# EasyEDA Pro project uven2-mk3-cc-driver-20x.eprj, board PCB1
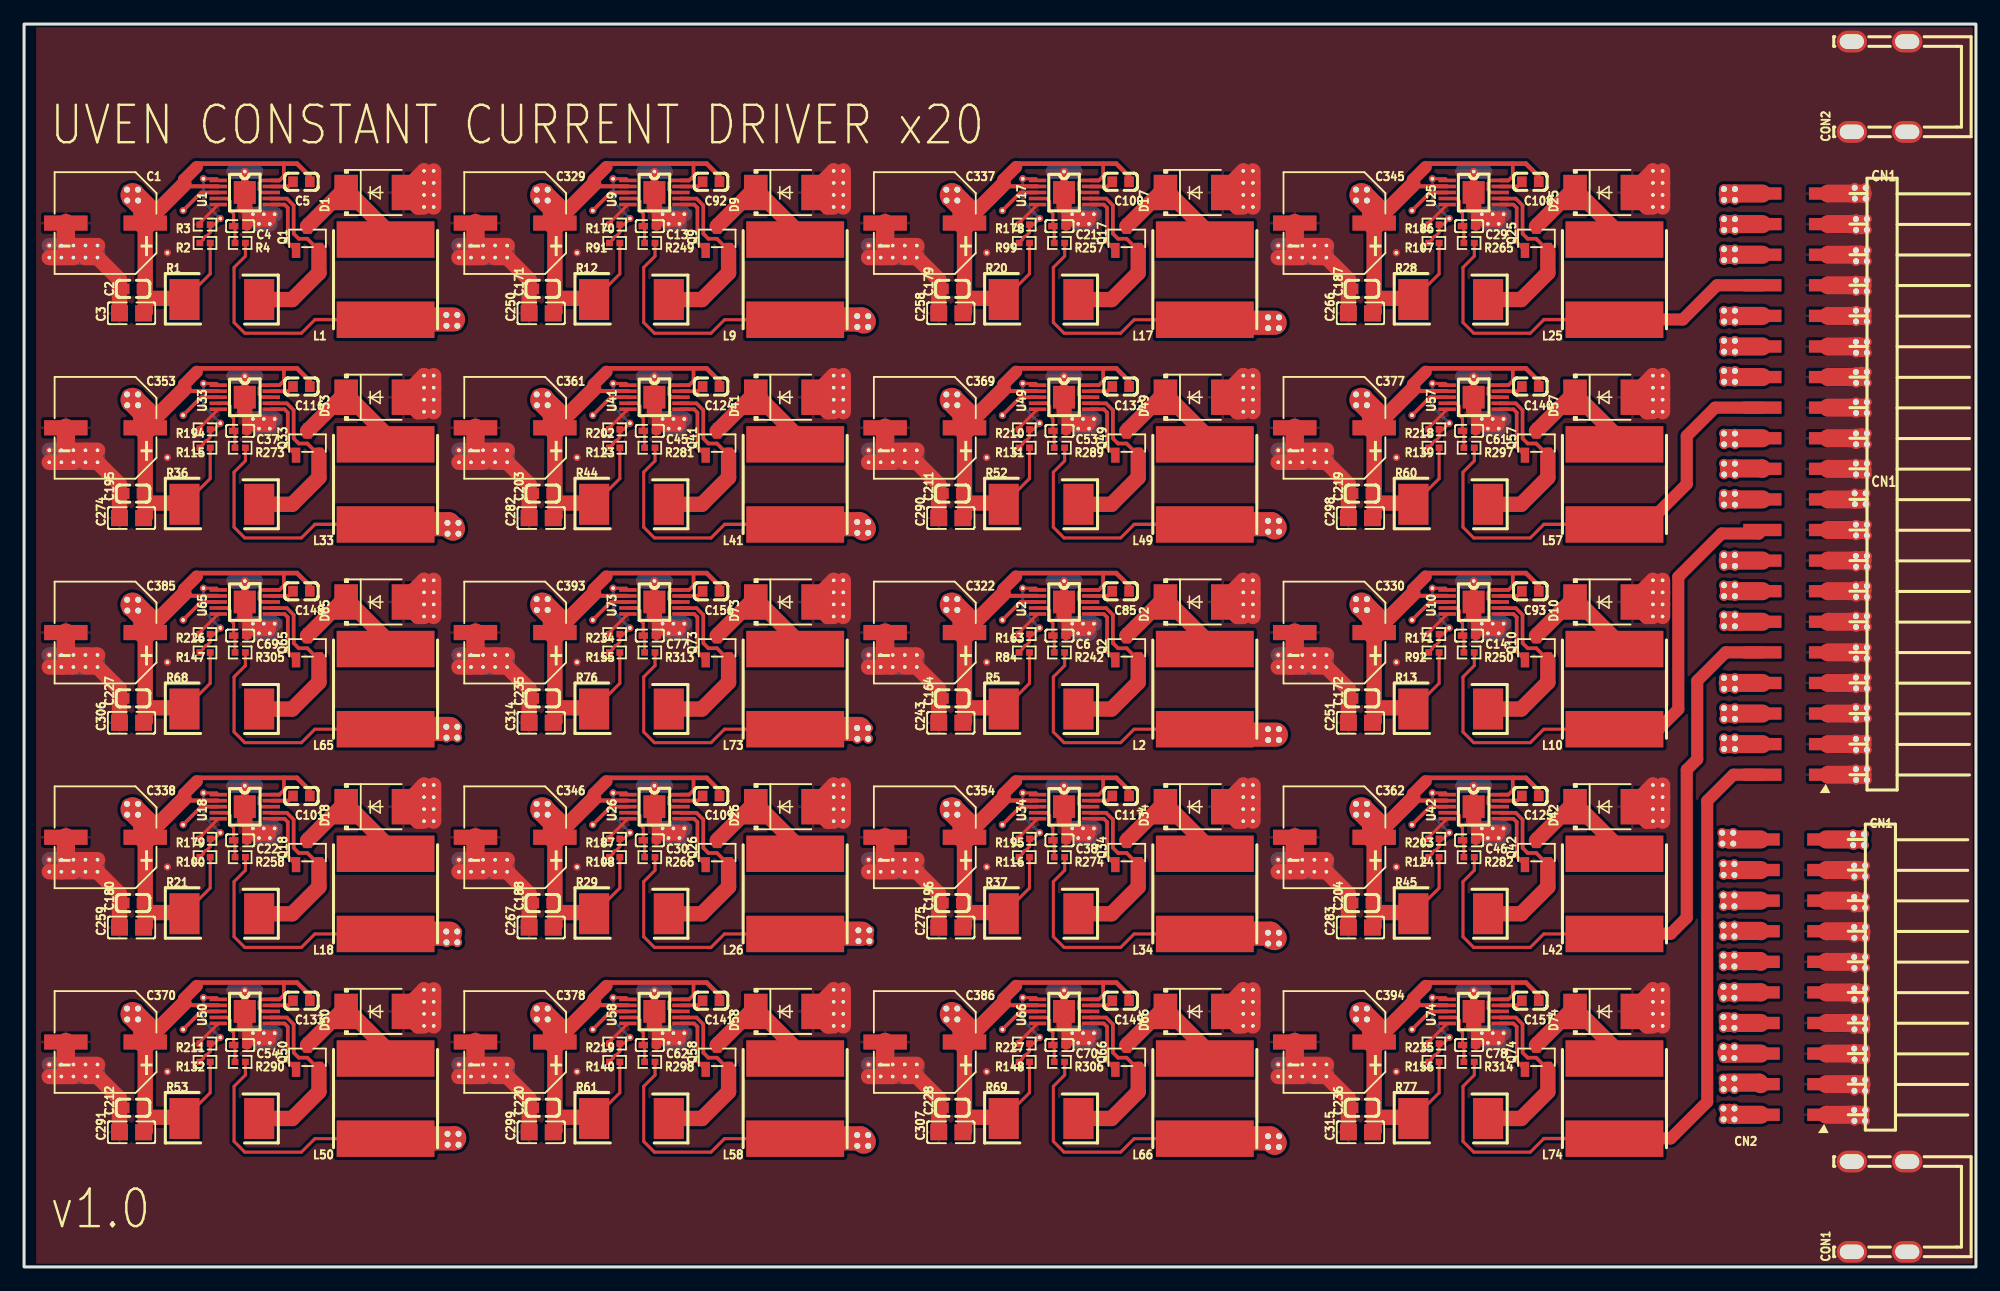
[diagram p4: board, top side]
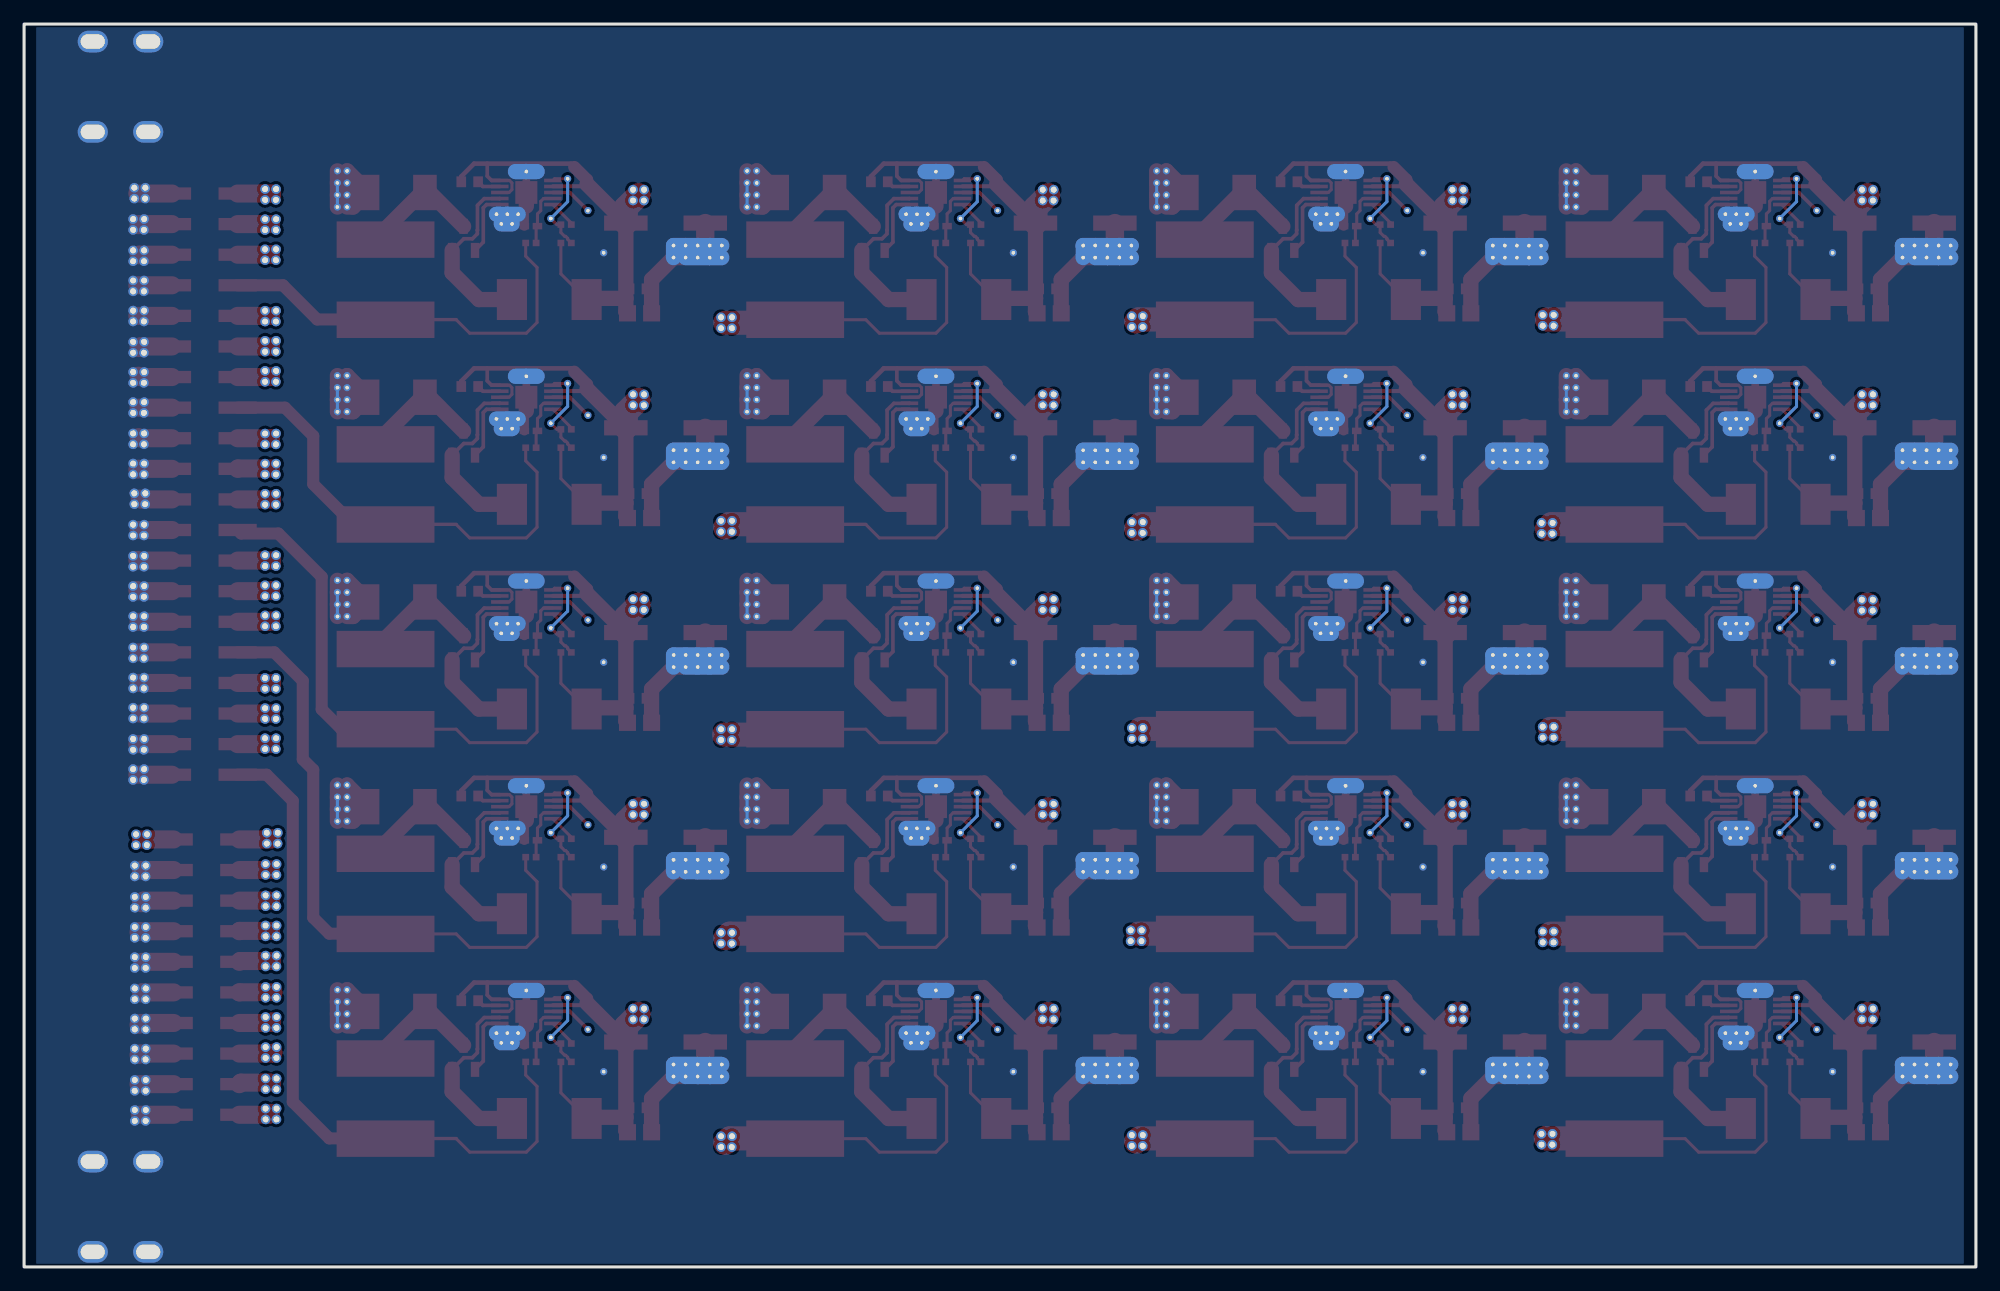
[diagram p5: board, bottom side, seen from below]

Outline 162 x 103.2 mm; copper layers: Top Layer, Inner1, Inner2, Bottom Layer. Coordinates in mm from the lower left corner of the outline.
Outline path: rectangle 0,103.2 162,0
Stack: Top Layer 0.035mm Outer layer thickness 1oz / Dielectric1 0.2104mm 7628 RC49% 8.6mil / Inner1 0.0152mm Inner layer thickness / Dielectric2 1.065mm 1.1mm H/HOZ Copper / Inner2 0.0152mm Inner layer thickness / Dielectric3 0.2104mm 7628 RC49% 8.6mil / Bottom Layer 0.035mm Outer layer thickness 1oz

## Design rules (mm)
template: Custom Config
spacing copperThickness1oz (default): track to track 0.102, other pairs 0.152 to 0.3
spacing copperThickness2oz: track to track 0.203, other pairs 0.152 to 0.3
track width copperThickness1oz (default): min 0.127, default 0.254, max 2.54
track width copperThickness2oz: min 0.203, default 0.254, max 2.54
differential pair differentialPair (default): width min 0.127, default 0.254, max 2.54; gap min 0.152, default 0.152
via viaSize (default): diameter min 0.5, default 0.61, max 10; hole min 0.3, default 0.305, max 6.3
pour e2918 uses copperRegion

## Placement (name value [footprint] x y rotation side)
C1  470uF  [CAP-SMD_BD8.0-L8.3-W8.3-LS9.1-FD]  6.76 86.68 180 top
C2  1uF  [C0603]  9.05 81.21 0 top
C3  10uF  [C0805]  8.92 79.18 0 top
C4  1nF  [C0402]  17.94 86.42 180 top
C5  1uF  [C0603]  23.02 90.1 0 top
C6  1nF  [C0402]  85.94 52.42 180 top
C13  1nF  [C0402]  51.94 86.42 180 top
C14  1nF  [C0402]  119.94 52.42 180 top
C21  1nF  [C0402]  85.94 86.42 180 top
C22  1nF  [C0402]  17.94 35.42 180 top
C29  1nF  [C0402]  119.94 86.42 180 top
C30  1nF  [C0402]  51.94 35.42 180 top
C37  1nF  [C0402]  17.94 69.42 180 top
C38  1nF  [C0402]  85.94 35.42 180 top
C45  1nF  [C0402]  51.94 69.42 180 top
C46  1nF  [C0402]  119.94 35.42 180 top
C53  1nF  [C0402]  85.94 69.42 180 top
C54  1nF  [C0402]  17.94 18.42 180 top
C61  1nF  [C0402]  119.94 69.42 180 top
C62  1nF  [C0402]  51.94 18.42 180 top
C69  1nF  [C0402]  17.94 52.42 180 top
C70  1nF  [C0402]  85.94 18.42 180 top
C77  1nF  [C0402]  51.94 52.42 180 top
C78  1nF  [C0402]  119.94 18.42 180 top
C85  1uF  [C0603]  91.01 56.1 0 top
C92  1uF  [C0603]  57.01 90.1 0 top
C93  1uF  [C0603]  125.01 56.1 0 top
C100  1uF  [C0603]  91.01 90.1 0 top
C101  1uF  [C0603]  23.02 39.1 0 top
C108  1uF  [C0603]  125.01 90.1 0 top
C109  1uF  [C0603]  57.01 39.1 0 top
C116  1uF  [C0603]  23.02 73.1 0 top
C117  1uF  [C0603]  91.01 39.1 0 top
C124  1uF  [C0603]  57.01 73.1 0 top
C125  1uF  [C0603]  125.01 39.1 0 top
C132  1uF  [C0603]  91.01 73.1 0 top
C133  1uF  [C0603]  23.02 22.1 0 top
C140  1uF  [C0603]  125.01 73.1 0 top
C141  1uF  [C0603]  57.01 22.1 0 top
C148  1uF  [C0603]  23.02 56.1 0 top
C149  1uF  [C0603]  91.01 22.1 0 top
C156  1uF  [C0603]  57.01 56.1 0 top
C157  1uF  [C0603]  125.01 22.1 0 top
C164  1uF  [C0603]  77.04 47.21 0 top
C171  1uF  [C0603]  43.05 81.21 0 top
C172  1uF  [C0603]  111.04 47.21 0 top
C179  1uF  [C0603]  77.04 81.21 0 top
C180  1uF  [C0603]  9.05 30.21 0 top
C187  1uF  [C0603]  111.04 81.21 0 top
C188  1uF  [C0603]  43.05 30.21 0 top
C195  1uF  [C0603]  9.05 64.21 0 top
C196  1uF  [C0603]  77.04 30.21 0 top
C203  1uF  [C0603]  43.05 64.21 0 top
C204  1uF  [C0603]  111.04 30.21 0 top
C211  1uF  [C0603]  77.04 64.21 0 top
C212  1uF  [C0603]  9.05 13.21 0 top
C219  1uF  [C0603]  111.04 64.21 0 top
C220  1uF  [C0603]  43.05 13.21 0 top
C227  1uF  [C0603]  9.05 47.21 0 top
C228  1uF  [C0603]  77.04 13.21 0 top
C235  1uF  [C0603]  43.05 47.21 0 top
C236  1uF  [C0603]  111.04 13.21 0 top
C243  10uF  [C0805]  76.92 45.18 0 top
C250  10uF  [C0805]  42.92 79.18 0 top
C251  10uF  [C0805]  110.92 45.18 0 top
C258  10uF  [C0805]  76.92 79.18 0 top
C259  10uF  [C0805]  8.92 28.18 0 top
C266  10uF  [C0805]  110.92 79.18 0 top
C267  10uF  [C0805]  42.92 28.18 0 top
C274  10uF  [C0805]  8.92 62.18 0 top
C275  10uF  [C0805]  76.92 28.18 0 top
C282  10uF  [C0805]  42.92 62.18 0 top
C283  10uF  [C0805]  110.92 28.18 0 top
C290  10uF  [C0805]  76.92 62.18 0 top
C291  10uF  [C0805]  8.92 11.18 0 top
C298  10uF  [C0805]  110.92 62.18 0 top
C299  10uF  [C0805]  42.92 11.18 0 top
C306  10uF  [C0805]  8.92 45.18 0 top
C307  10uF  [C0805]  76.92 11.18 0 top
C314  10uF  [C0805]  42.92 45.18 0 top
C315  10uF  [C0805]  110.92 11.18 0 top
C322  470uF  [CAP-SMD_BD8.0-L8.3-W8.3-LS9.1-FD]  74.76 52.68 180 top
C329  470uF  [CAP-SMD_BD8.0-L8.3-W8.3-LS9.1-FD]  40.76 86.68 180 top
C330  470uF  [CAP-SMD_BD8.0-L8.3-W8.3-LS9.1-FD]  108.76 52.68 180 top
C337  470uF  [CAP-SMD_BD8.0-L8.3-W8.3-LS9.1-FD]  74.76 86.68 180 top
C338  470uF  [CAP-SMD_BD8.0-L8.3-W8.3-LS9.1-FD]  6.76 35.68 180 top
C345  470uF  [CAP-SMD_BD8.0-L8.3-W8.3-LS9.1-FD]  108.76 86.68 180 top
C346  470uF  [CAP-SMD_BD8.0-L8.3-W8.3-LS9.1-FD]  40.76 35.68 180 top
C353  470uF  [CAP-SMD_BD8.0-L8.3-W8.3-LS9.1-FD]  6.76 69.68 180 top
C354  470uF  [CAP-SMD_BD8.0-L8.3-W8.3-LS9.1-FD]  74.76 35.68 180 top
C361  470uF  [CAP-SMD_BD8.0-L8.3-W8.3-LS9.1-FD]  40.76 69.68 180 top
C362  470uF  [CAP-SMD_BD8.0-L8.3-W8.3-LS9.1-FD]  108.76 35.68 180 top
C369  470uF  [CAP-SMD_BD8.0-L8.3-W8.3-LS9.1-FD]  74.76 69.68 180 top
C370  470uF  [CAP-SMD_BD8.0-L8.3-W8.3-LS9.1-FD]  6.76 18.68 180 top
C377  470uF  [CAP-SMD_BD8.0-L8.3-W8.3-LS9.1-FD]  108.76 69.68 180 top
C378  470uF  [CAP-SMD_BD8.0-L8.3-W8.3-LS9.1-FD]  40.76 18.68 180 top
C385  470uF  [CAP-SMD_BD8.0-L8.3-W8.3-LS9.1-FD]  6.76 52.68 180 top
C386  470uF  [CAP-SMD_BD8.0-L8.3-W8.3-LS9.1-FD]  74.76 18.68 180 top
C393  470uF  [CAP-SMD_BD8.0-L8.3-W8.3-LS9.1-FD]  40.76 52.68 180 top
C394  470uF  [CAP-SMD_BD8.0-L8.3-W8.3-LS9.1-FD]  108.76 18.68 180 top
CN1  PZ254-2-20-WS  [HDR-SMD_40P-P2.54-H-M-R2-C20_L8.5]  147 65 90 top
CN2  PZ254-2-10-WS  [HDR-SMD_20P-P2.54-H-M-R2-C10_L8.5]  146.86 24.06 90 top
CON1  TTR34083132-1140  [TH-4_L11.4-W8.3_TTR34083132-1140]  154 5 90 top
CON2  TTR34083132-1140  [TH-4_L11.4-W8.3_TTR34083132-1140]  154 98 90 top
D1  SR34_R2_00001  [SMB_L4.3-W3.6-LS5.4-R-RD]  29.11 89.22 0 top
D2  SR34_R2_00001  [SMB_L4.3-W3.6-LS5.4-R-RD]  97.11 55.22 0 top
D9  SR34_R2_00001  [SMB_L4.3-W3.6-LS5.4-R-RD]  63.11 89.22 0 top
D10  SR34_R2_00001  [SMB_L4.3-W3.6-LS5.4-R-RD]  131.11 55.22 0 top
D17  SR34_R2_00001  [SMB_L4.3-W3.6-LS5.4-R-RD]  97.11 89.22 0 top
D18  SR34_R2_00001  [SMB_L4.3-W3.6-LS5.4-R-RD]  29.11 38.22 0 top
D25  SR34_R2_00001  [SMB_L4.3-W3.6-LS5.4-R-RD]  131.11 89.22 0 top
D26  SR34_R2_00001  [SMB_L4.3-W3.6-LS5.4-R-RD]  63.11 38.22 0 top
D33  SR34_R2_00001  [SMB_L4.3-W3.6-LS5.4-R-RD]  29.11 72.22 0 top
D34  SR34_R2_00001  [SMB_L4.3-W3.6-LS5.4-R-RD]  97.11 38.22 0 top
D41  SR34_R2_00001  [SMB_L4.3-W3.6-LS5.4-R-RD]  63.11 72.22 0 top
D42  SR34_R2_00001  [SMB_L4.3-W3.6-LS5.4-R-RD]  131.11 38.22 0 top
D49  SR34_R2_00001  [SMB_L4.3-W3.6-LS5.4-R-RD]  97.11 72.22 0 top
D50  SR34_R2_00001  [SMB_L4.3-W3.6-LS5.4-R-RD]  29.11 21.22 0 top
D57  SR34_R2_00001  [SMB_L4.3-W3.6-LS5.4-R-RD]  131.11 72.22 0 top
D58  SR34_R2_00001  [SMB_L4.3-W3.6-LS5.4-R-RD]  63.11 21.22 0 top
D65  SR34_R2_00001  [SMB_L4.3-W3.6-LS5.4-R-RD]  29.11 55.22 0 top
D66  SR34_R2_00001  [SMB_L4.3-W3.6-LS5.4-R-RD]  97.11 21.22 0 top
D73  SR34_R2_00001  [SMB_L4.3-W3.6-LS5.4-R-RD]  63.11 55.22 0 top
D74  SR34_R2_00001  [SMB_L4.3-W3.6-LS5.4-R-RD]  131.11 21.22 0 top
L1  15uH  [IND-SMD_L8.0-W8.0-HPC8040NF-150M]  30 81.98 90 top
L2  15uH  [IND-SMD_L8.0-W8.0-HPC8040NF-150M]  98 47.98 90 top
L9  15uH  [IND-SMD_L8.0-W8.0-HPC8040NF-150M]  64 81.98 90 top
L10  15uH  [IND-SMD_L8.0-W8.0-HPC8040NF-150M]  132 47.98 90 top
L17  15uH  [IND-SMD_L8.0-W8.0-HPC8040NF-150M]  98 81.98 90 top
L18  15uH  [IND-SMD_L8.0-W8.0-HPC8040NF-150M]  30 30.98 90 top
L25  15uH  [IND-SMD_L8.0-W8.0-HPC8040NF-150M]  132 81.98 90 top
L26  15uH  [IND-SMD_L8.0-W8.0-HPC8040NF-150M]  64 30.98 90 top
L33  15uH  [IND-SMD_L8.0-W8.0-HPC8040NF-150M]  30 64.98 90 top
L34  15uH  [IND-SMD_L8.0-W8.0-HPC8040NF-150M]  98 30.98 90 top
L41  15uH  [IND-SMD_L8.0-W8.0-HPC8040NF-150M]  64 64.98 90 top
L42  15uH  [IND-SMD_L8.0-W8.0-HPC8040NF-150M]  132 30.98 90 top
L49  15uH  [IND-SMD_L8.0-W8.0-HPC8040NF-150M]  98 64.98 90 top
L50  15uH  [IND-SMD_L8.0-W8.0-HPC8040NF-150M]  30 13.98 90 top
L57  15uH  [IND-SMD_L8.0-W8.0-HPC8040NF-150M]  132 64.98 90 top
L58  15uH  [IND-SMD_L8.0-W8.0-HPC8040NF-150M]  64 13.98 90 top
L65  15uH  [IND-SMD_L8.0-W8.0-HPC8040NF-150M]  30 47.98 90 top
L66  15uH  [IND-SMD_L8.0-W8.0-HPC8040NF-150M]  98 13.98 90 top
L73  15uH  [IND-SMD_L8.0-W8.0-HPC8040NF-150M]  64 47.98 90 top
L74  15uH  [IND-SMD_L8.0-W8.0-HPC8040NF-150M]  132 13.98 90 top
NOREF  -  [Pad_e3252]  152.81 30.72 0 top
NOREF#2  -  [Pad_e7711]  107.09 66.81 0 top
NOREF#3  -  [Pad_e7423]  101.19 73.01 0 top
NOREF#4  -  [Pad_e3453]  152.95 42.94 0 top
NOREF#5  -  [Pad_e6207]  19.49 35.61 0 top
NOREF#6  -  [Pad_e7069]  67.19 73.01 0 top
NOREF#7  -  [Pad_e11088]  8.56 71.55 0 top
NOREF#8  -  [Pad_e5895]  104.09 50.81 0 top
NOREF#9  -  [Pad_e6359]  107.09 83.81 0 top
NOREF#10  -  [Pad_e8305]  37.09 49.81 0 top
NOREF#11  -  [Pad_e7418]  88.39 69.61 0 top
NOREF#12  -  [Pad_e7417]  88.79 70.41 0 top
NOREF#13  -  [Pad_e3258]  151.9 30.72 0 top
NOREF#14  -  [Pad_e7567]  20.39 18.61 0 top
NOREF#15  -  [Pad_e3230]  152.81 33.32 0 top
NOREF#16  -  [Pad_e3595]  152.04 59.04 0 top
NOREF#17  -  [Pad_e7407]  72.09 67.81 0 top
NOREF#18  -  [Pad_e8309]  52.99 53.41 0 top
NOREF#19  -  [Pad_e6725]  33.19 72.01 0 top
NOREF#20  -  [Pad_e2909]  141.04 15.65 0 top
NOREF#21  -  [Pad_e3672]  152.05 78.51 0 top
NOREF#22  -  [Pad_e2938]  152.81 12.12 0 top
NOREF#23  -  [Pad_e11057]  70.06 60.95 0 top
NOREF#24  -  [Pad_e3110]  151.91 17.22 0 top
NOREF#25  -  [Pad_e2718]  141.96 27.45 0 top
NOREF#26  -  [Pad_e8297]  48.89 56.36 0 top
NOREF#27  -  [Pad_e8308]  40.09 49.81 0 top
NOREF#28  -  [Pad_e8446]  116.89 22.36 0 top
NOREF#29  -  [Pad_e8148]  82.89 22.36 0 top
NOREF#30  -  [Pad_e5906]  121.89 53.41 0 top
NOREF#31  -  [Pad_e11022]  70.06 10.95 0 top
NOREF#32  -  [Pad_e7213]  104.09 32.81 0 top
NOREF#33  -  [Pad_e3820]  152.04 66.71 0 top
NOREF#34  -  [Pad_e3208]  151.8 35.92 0 top
NOREF#35  -  [Pad_e7070]  67.99 72.01 0 top
NOREF#36  -  [Pad_e8321]  67.99 56.01 0 top
NOREF#37  -  [Pad_e5619]  101.99 56.01 0 top
NOREF#38  -  [Pad_e5897]  106.09 50.81 0 top
NOREF#39  -  [Pad_e7856]  40.09 16.81 0 top
NOREF#40  -  [Pad_e7708]  104.09 66.81 0 top
NOREF#41  -  [Pad_e11117]  43.46 71.55 0 top
NOREF#42  -  [Pad_e7850]  48.89 22.36 0 top
NOREF#43  -  [Pad_e1664]  141.09 56.6 0 top
NOREF#44  -  [Pad_e6894]  86.32 39.95 0 top
NOREF#45  -  [Pad_e6060]  101.19 91.01 0 top
NOREF#46  -  [Pad_e11143]  76.54 21.45 0 top
NOREF#47  -  [Pad_e11055]  35.14 61.78 0 top
NOREF#48  -  [Pad_e6194]  3.09 33.81 0 top
NOREF#49  -  [Pad_e7570]  33.19 23.01 0 top
NOREF#50  -  [Pad_e5913]  135.19 56.01 0 top
NOREF#51  -  [Pad_e3818]  152.04 69.21 0 top
NOREF#52  -  [Pad_e7575]  33.99 20.01 0 top
NOREF#53  -  [Pad_e5610]  88.39 52.61 0 top
NOREF#54  -  [Pad_e8174]  79.89 16.21 0 top
NOREF#55  -  [Pad_e11160]  110.56 88.55 0 top
NOREF#56  -  [Pad_e2963]  152.81 27.32 0 top
NOREF#57  -  [Pad_e6530]  36.09 32.81 0 top
NOREF#58  -  [Pad_e6880]  74.09 32.81 0 top
NOREF#59  -  [Pad_e3182]  152.71 35.02 0 top
NOREF#60  -  [Pad_e5766]  67.99 91.01 0 top
NOREF#61  -  [Pad_e5920]  115.2 53.72 0 top
NOREF#62  -  [Pad_e6052]  73.09 83.81 0 top
NOREF#63  -  [Pad_e2076]  142 69.2 0 top
NOREF#64  -  [Pad_e5764]  67.19 90.01 0 top
NOREF#65  -  [Pad_e6719]  6.09 66.81 0 top
NOREF#66  -  [Pad_e5763]  67.19 88.01 0 top
NOREF#67  -  [Pad_e3379]  152.95 48.04 0 top
NOREF#68  -  [Pad_e5447]  16.28 87.06 0 top
NOREF#69  -  [Pad_e11025]  36.06 10.15 0 top
NOREF#70  -  [Pad_e3475]  152.05 42.94 0 top
NOREF#71  -  [Pad_e11098]  9.46 38.45 0 top
NOREF#72  -  [Pad_e7404]  84.28 70.06 0 top
NOREF#73  -  [Pad_e7851]  50.28 19.06 0 top
NOREF#74  -  [Pad_e8023]  33.99 56.01 0 top
NOREF#75  -  [Pad_e3007]  152.81 25.72 0 top
NOREF#76  -  [Pad_e6710]  2.09 67.81 0 top
NOREF#77  -  [Pad_e5909]  121.49 52.61 0 top
NOREF#78  -  [Pad_e6875]  74.09 33.81 0 top
NOREF#79  -  [Pad_e2644]  141.96 32.55 0 top
NOREF#80  -  [Pad_e11131]  76.54 72.45 0 top
NOREF#81  -  [Pad_e2838]  141.06 19.85 0 top
NOREF#82  -  [Pad_e6064]  101.99 91.01 0 top
NOREF#83  -  [Pad_e5601]  74.09 50.81 0 top
NOREF#84  -  [Pad_e11105]  43.46 20.55 0 top
NOREF#85  -  [Pad_e3649]  152.04 81.91 0 top
NOREF#86  -  [Pad_e3476]  152.04 43.84 0 top
NOREF#87  -  [Pad_e3644]  152.05 81.01 0 top
NOREF#88  -  [Pad_e2817]  141.96 20.75 0 top
NOREF#89  -  [Pad_e7403]  82.89 73.36 0 top
NOREF#90  -  [Pad_e5767]  67.99 88.01 0 top
NOREF#91  -  [Pad_e11083]  8.54 89.45 0 top
NOREF#92  -  [Pad_e2691]  141.96 29.95 0 top
NOREF#93  -  [Pad_e8014]  20.39 52.61 0 top
NOREF#94  -  [Pad_e7208]  104.09 33.81 0 top
NOREF#95  -  [Pad_e6213]  33.99 40.01 0 top
NOREF#96  -  [Pad_e11155]  110.54 55.45 0 top
NOREF#97  -  [Pad_e11032]  69.26 27.05 0 top
NOREF#98  -  [Pad_e7416]  87.89 70.41 0 top
NOREF#99  -  [Pad_e6876]  70.09 32.81 0 top
NOREF#100  -  [Pad_e6882]  87.89 36.41 0 top
NOREF#101  -  [Pad_e6044]  70.09 84.81 0 top
NOREF#102  -  [Pad_e7406]  71.09 67.81 0 top
NOREF#103  -  [Pad_e6210]  33.19 37.01 0 top
NOREF#104  -  [Pad_e6549]  67.99 39.01 0 top
NOREF#105  -  [Pad_e5458]  18.99 87.41 0 top
NOREF#106  -  [Pad_e6540]  54.39 35.61 0 top
NOREF#107  -  [Pad_e8153]  73.09 16.81 0 top
NOREF#108  -  [Pad_e11064]  103.26 77.95 0 top
NOREF#109  -  [Pad_e7876]  45.89 16.21 0 top
NOREF#110  -  [Pad_e3573]  152.04 61.64 0 top
NOREF#111  -  [Pad_e11093]  9.47 54.5 0 top
NOREF#112  -  [Pad_e5620]  86.32 56.95 0 top
NOREF#113  -  [Pad_e8451]  107.09 16.81 0 top
NOREF#114  -  [Pad_e11129]  77.46 71.55 0 top
NOREF#115  -  [Pad_e5902]  106.09 49.81 0 top
NOREF#116  -  [Pad_e5446]  14.89 90.36 0 top
NOREF#117  -  [Pad_e7566]  20.79 19.41 0 top
NOREF#118  -  [Pad_e7564]  18.99 19.41 0 top
NOREF#119  -  [Pad_e11099]  8.54 38.45 0 top
NOREF#120  -  [Pad_e8152]  72.09 16.81 0 top
NOREF#121  -  [Pad_e8151]  71.09 16.81 0 top
NOREF#122  -  [Pad_e11043]  103.24 44.65 0 top
NOREF#123  -  [Pad_e6201]  5.09 32.81 0 top
NOREF#124  -  [Pad_e3061]  152.81 19.72 0 top
NOREF#125  -  [Pad_e5910]  135.19 55.01 0 top
NOREF#126  -  [Pad_e6360]  108.09 83.81 0 top
NOREF#127  -  [Pad_e6049]  70.09 83.81 0 top
NOREF#128  -  [Pad_e8471]  120.32 22.96 0 top
NOREF#129  -  [Pad_e3840]  152.95 83.51 0 top
NOREF#130  -  [Pad_e8301]  38.09 50.81 0 top
NOREF#131  -  [Pad_e7871]  67.99 21.01 0 top
NOREF#132  -  [Pad_e6055]  87.89 87.41 0 top
NOREF#133  -  [Pad_e6054]  86.99 87.41 0 top
NOREF#134  -  [Pad_e3650]  152.95 78.51 0 top
NOREF#135  -  [Pad_e5611]  87.49 52.61 0 top
NOREF#136  -  [Pad_e11148]  110.56 37.55 0 top
NOREF#137  -  [Pad_e3552]  152.05 60.74 0 top
NOREF#138  -  [Pad_e6065]  101.99 88.01 0 top
NOREF#139  -  [Pad_e11130]  77.46 72.45 0 top
NOREF#140  -  [Pad_e7572]  33.19 22.01 0 top
NOREF#141  -  [Pad_e3791]  152.95 68.31 0 top
NOREF#142  -  [Pad_e5916]  135.99 54.01 0 top
NOREF#143  -  [Pad_e11152]  110.56 54.55 0 top
NOREF#144  -  [Pad_e6548]  67.99 37.01 0 top
NOREF#145  -  [Pad_e8026]  13.2 53.72 0 top
NOREF#146  -  [Pad_e7408]  73.09 67.81 0 top
NOREF#147  -  [Pad_e8452]  108.09 16.81 0 top
NOREF#148  -  [Pad_e8006]  2.09 49.81 0 top
NOREF#149  -  [Pad_e8448]  104.09 16.81 0 top
NOREF#150  -  [Pad_e8323]  45.89 50.21 0 top
NOREF#151  -  [Pad_e1713]  142 43.9 0 top
NOREF#152  -  [Pad_e3159]  152.81 13.03 0 top
NOREF#153  -  [Pad_e3084]  151.9 20.62 0 top
NOREF#154  -  [Pad_e8469]  135.99 20.01 0 top
NOREF#155  -  [Pad_e5901]  105.09 49.81 0 top
NOREF#156  -  [Pad_e8304]  36.09 49.81 0 top
NOREF#157  -  [Pad_e8456]  107.09 15.81 0 top
NOREF#158  -  [Pad_e11123]  42.54 89.45 0 top
NOREF#159  -  [Pad_e6358]  106.09 83.81 0 top
NOREF#160  -  [Pad_e5614]  101.19 54.01 0 top
NOREF#161  -  [Pad_e11033]  70.16 27.05 0 top
NOREF#162  -  [Pad_e5744]  48.89 90.36 0 top
NOREF#163  -  [Pad_e1734]  141.09 43.9 0 top
NOREF#164  -  [Pad_e7059]  39.09 66.81 0 top
NOREF#165  -  [Pad_e2082]  141.09 69.2 0 top
NOREF#166  -  [Pad_e7562]  5.09 15.81 0 top
NOREF#167  -  [Pad_e5456]  5.09 83.81 0 top
NOREF#168  -  [Pad_e7412]  72.09 66.81 0 top
NOREF#169  -  [Pad_e7565]  19.89 19.41 0 top
NOREF#170  -  [Pad_e11157]  111.46 71.55 0 top
NOREF#171  -  [Pad_e7573]  33.99 21.01 0 top
NOREF#172  -  [Pad_e7225]  122.39 35.61 0 top
NOREF#173  -  [Pad_e7725]  135.99 73.01 0 top
NOREF#174  -  [Pad_e2664]  141.96 33.45 0 top
NOREF#175  -  [Pad_e7056]  36.09 66.81 0 top
NOREF#176  -  [Pad_e3134]  151.91 14.62 0 top
NOREF#177  -  [Pad_e5758]  54.79 87.41 0 top
NOREF#178  -  [Pad_e5759]  54.39 86.61 0 top
NOREF#179  -  [Pad_e5605]  73.09 49.81 0 top
NOREF#180  -  [Pad_e5612]  101.19 55.01 0 top
NOREF#181  -  [Pad_e11034]  70.16 27.95 0 top
NOREF#182  -  [Pad_e6375]  135.99 88.01 0 top
NOREF#183  -  [Pad_e11135]  76.54 55.45 0 top
NOREF#184  -  [Pad_e3868]  151.94 89.61 0 top
NOREF#185  -  [Pad_e6542]  67.19 38.01 0 top
NOREF#186  -  [Pad_e2740]  141.06 27.45 0 top
NOREF#187  -  [Pad_e6551]  45.89 33.21 0 top
NOREF#188  -  [Pad_e7578]  11.89 16.21 0 top
NOREF#189  -  [Pad_e7866]  53.49 18.61 0 top
NOREF#190  -  [Pad_e6536]  52.99 36.41 0 top
NOREF#191  -  [Pad_e7421]  101.19 74.01 0 top
NOREF#192  -  [Pad_e3280]  152.05 40.44 0 top
NOREF#193  -  [Pad_e2301]  141.1 86.1 0 top
NOREF#194  -  [Pad_e5618]  101.99 54.01 0 top
NOREF#195  -  [Pad_e8298]  50.28 53.06 0 top
NOREF#196  -  [Pad_e7072]  67.99 71.01 0 top
NOREF#197  -  [Pad_e8169]  101.99 21.01 0 top
NOREF#198  -  [Pad_e6722]  20.79 70.41 0 top
NOREF#199  -  [Pad_e3399]  152.95 48.94 0 top
NOREF#200  -  [Pad_e7233]  135.19 37.01 0 top
NOREF#201  -  [Pad_e3448]  152.04 46.44 0 top
NOREF#202  -  [Pad_e6205]  20.79 36.41 0 top
NOREF#203  -  [Pad_e11128]  76.56 71.55 0 top
NOREF#204  -  [Pad_e7862]  52.99 19.41 0 top
NOREF#205  -  [Pad_e7224]  122.79 36.41 0 top
NOREF#206  -  [Pad_e1616]  141.1 58.2 0 top
NOREF#207  -  [Pad_e7047]  36.09 67.81 0 top
NOREF#208  -  [Pad_e11107]  42.54 21.45 0 top
NOREF#209  -  [Pad_e7720]  135.19 71.01 0 top
NOREF#210  -  [Pad_e8002]  3.09 50.81 0 top
NOREF#211  -  [Pad_e5457]  6.09 83.81 0 top
NOREF#212  -  [Pad_e2057]  142 68.3 0 top
NOREF#213  -  [Pad_e7055]  40.09 67.81 0 top
NOREF#214  -  [Pad_e3503]  152.85 63.34 0 top
NOREF#215  -  [Pad_e5595]  82.89 56.36 0 top
NOREF#216  -  [Pad_e6525]  37.09 33.81 0 top
NOREF#217  -  [Pad_e6218]  13.2 36.72 0 top
NOREF#218  -  [Pad_e5606]  74.09 49.81 0 top
NOREF#219  -  [Pad_e2370]  141.86 36.05 0 top
NOREF#220  -  [Pad_e3034]  152.81 22.22 0 top
NOREF#221  -  [Pad_e1740]  142 46.4 0 top
NOREF#222  -  [Pad_e6377]  120.32 90.95 0 top
NOREF#223  -  [Pad_e11134]  77.46 55.45 0 top
NOREF#224  -  [Pad_e2811]  141.04 23.25 0 top
NOREF#225  -  [Pad_e2839]  141.04 20.75 0 top
NOREF#226  -  [Pad_e7728]  115.2 70.72 0 top
NOREF#227  -  [Pad_e3917]  152.05 83.51 0 top
NOREF#228  -  [Pad_e6063]  101.99 89.01 0 top
NOREF#229  -  [Pad_e3232]  151.9 33.32 0 top
NOREF#230  -  [Pad_e2201]  142 76 0 top
NOREF#231  -  [Pad_e6200]  4.09 32.81 0 top
NOREF#232  -  [Pad_e7859]  38.09 15.81 0 top
NOREF#233  -  [Pad_e11062]  104.16 61.95 0 top
NOREF#234  -  [Pad_e5469]  33.99 88.01 0 top
NOREF#235  -  [Pad_e6368]  135.19 89.01 0 top
NOREF#236  -  [Pad_e6717]  4.09 66.81 0 top
NOREF#237  -  [Pad_e8460]  122.79 19.41 0 top
NOREF#238  -  [Pad_e2376]  140.94 36.05 0 top
NOREF#239  -  [Pad_e3742]  152.05 73.41 0 top
NOREF#240  -  [Pad_e2327]  142 84.5 0 top
NOREF#241  -  [Pad_e2272]  142 89.5 0 top
NOREF#242  -  [Pad_e11090]  9.46 72.45 0 top
NOREF#243  -  [Pad_e5762]  67.19 91.01 0 top
NOREF#244  -  [Pad_e5908]  122.39 52.61 0 top
NOREF#245  -  [Pad_e7212]  108.09 33.81 0 top
NOREF#246  -  [Pad_e7553]  16.28 19.06 0 top
NOREF#247  -  [Pad_e8450]  106.09 16.81 0 top
NOREF#248  -  [Pad_e6062]  101.19 90.01 0 top
NOREF#249  -  [Pad_e3551]  152.95 61.64 0 top
NOREF#250  -  [Pad_e6053]  74.09 83.81 0 top
NOREF#251  -  [Pad_e3378]  152.04 51.44 0 top
NOREF#252  -  [Pad_e11101]  9.46 20.55 0 top
NOREF#253  -  [Pad_e6370]  135.19 88.01 0 top
NOREF#254  -  [Pad_e11016]  103.26 9.95 0 top
NOREF#255  -  [Pad_e6531]  37.09 32.81 0 top
NOREF#256  -  [Pad_e11074]  35.96 79.05 0 top
NOREF#257  -  [Pad_e6379]  115.2 87.72 0 top
NOREF#258  -  [Pad_e6204]  19.89 36.41 0 top
NOREF#259  -  [Pad_e6868]  82.89 39.36 0 top
NOREF#260  -  [Pad_e2203]  141.1 76 0 top
NOREF#261  -  [Pad_e8458]  120.99 19.41 0 top
NOREF#262  -  [Pad_e5615]  101.19 56.01 0 top
NOREF#263  -  [Pad_e6529]  40.09 33.81 0 top
NOREF#264  -  [Pad_e11065]  104.16 77.95 0 top
NOREF#265  -  [Pad_e8149]  84.28 19.06 0 top
NOREF#266  -  [Pad_e5467]  33.99 89.01 0 top
NOREF#267  -  [Pad_e2130]  142 63.3 0 top
NOREF#268  -  [Pad_e11163]  110.54 89.45 0 top
NOREF#269  -  [Pad_e7857]  36.09 15.81 0 top
NOREF#270  -  [Pad_e11021]  70.06 10.05 0 top
NOREF#271  -  [Pad_e11150]  111.46 38.45 0 top
NOREF#272  -  [Pad_e8310]  53.89 53.41 0 top
NOREF#273  -  [Pad_e11066]  104.16 78.85 0 top
NOREF#274  -  [Pad_e3622]  152.05 65.81 0 top
NOREF#275  -  [Pad_e6533]  39.09 32.81 0 top
NOREF#276  -  [Pad_e2692]  141.96 30.85 0 top
NOREF#277  -  [Pad_e7060]  40.09 66.81 0 top
NOREF#278  -  [Pad_e7210]  106.09 33.81 0 top
NOREF#279  -  [Pad_e2985]  151.91 27.32 0 top
NOREF#280  -  [Pad_e7245]  115.2 36.72 0 top
NOREF#281  -  [Pad_e7419]  87.49 69.61 0 top
NOREF#282  -  [Pad_e11153]  111.46 54.55 0 top
NOREF#283  -  [Pad_e5750]  40.09 84.81 0 top
NOREF#284  -  [Pad_e11053]  36.05 60.88 0 top
NOREF#285  -  [Pad_e8003]  4.09 50.81 0 top
NOREF#286  -  [Pad_e2762]  141.96 25.85 0 top
NOREF#287  -  [Pad_e6045]  71.09 84.81 0 top
NOREF#288  -  [Pad_e8017]  33.19 57.01 0 top
NOREF#289  -  [Pad_e6208]  33.19 38.01 0 top
NOREF#290  -  [Pad_e5607]  86.99 53.41 0 top
NOREF#291  -  [Pad_e1739]  142 45.5 0 top
NOREF#292  -  [Pad_e11140]  76.56 20.55 0 top
NOREF#293  -  [Pad_e8011]  18.99 53.41 0 top
NOREF#294  -  [Pad_e6541]  53.49 35.61 0 top
NOREF#295  -  [Pad_e7076]  47.2 70.72 0 top
NOREF#296  -  [Pad_e8472]  113.89 16.21 0 top
NOREF#297  -  [Pad_e6042]  82.89 90.36 0 top
NOREF#298  -  [Pad_e2693]  141.06 29.95 0 top
NOREF#299  -  [Pad_e7860]  39.09 15.81 0 top
NOREF#300  -  [Pad_e5473]  13.2 87.72 0 top
NOREF#301  -  [Pad_e6890]  101.99 38.01 0 top
NOREF#302  -  [Pad_e7051]  39.09 67.81 0 top
NOREF#303  -  [Pad_e3846]  152.85 89.61 0 top
NOREF#304  -  [Pad_e7050]  38.09 67.81 0 top
NOREF#305  -  [Pad_e7719]  135.19 74.01 0 top
NOREF#306  -  [Pad_e6043]  84.28 87.06 0 top
NOREF#307  -  [Pad_e7715]  122.79 70.41 0 top
NOREF#308  -  [Pad_e6192]  16.28 36.06 0 top
NOREF#309  -  [Pad_e3869]  152.95 86.11 0 top
NOREF#310  -  [Pad_e3916]  152.95 84.41 0 top
NOREF#311  -  [Pad_e11121]  43.46 88.55 0 top
NOREF#312  -  [Pad_e2180]  141.09 79.4 0 top
NOREF#313  -  [Pad_e11108]  42.56 37.55 0 top
NOREF#314  -  [Pad_e6361]  120.99 87.41 0 top
NOREF#315  -  [Pad_e6354]  107.09 84.81 0 top
NOREF#316  -  [Pad_e3720]  152.04 76.81 0 top
NOREF#317  -  [Pad_e7558]  6.09 16.81 0 top
NOREF#318  -  [Pad_e3575]  152.05 58.14 0 top
NOREF#319  -  [Pad_e3601]  152.95 65.81 0 top
NOREF#320  -  [Pad_e3671]  152.95 79.41 0 top
NOREF#321  -  [Pad_e6728]  33.19 73.01 0 top
NOREF#322  -  [Pad_e11124]  76.56 88.55 0 top
NOREF#323  -  [Pad_e6715]  2.09 66.81 0 top
NOREF#324  -  [Pad_e7702]  118.28 70.06 0 top
NOREF#325  -  [Pad_e3889]  152.95 87.01 0 top
NOREF#326  -  [Pad_e11139]  76.54 38.45 0 top
NOREF#327  -  [Pad_e6878]  72.09 32.81 0 top
NOREF#328  -  [Pad_e6363]  122.79 87.41 0 top
NOREF#329  -  [Pad_e6357]  105.09 83.81 0 top
NOREF#330  -  [Pad_e3427]  152.95 46.44 0 top
NOREF#331  -  [Pad_e8168]  101.19 22.01 0 top
NOREF#332  -  [Pad_e8468]  135.99 23.01 0 top
NOREF#333  -  [Pad_e8008]  4.09 49.81 0 top
NOREF#334  -  [Pad_e7868]  67.19 23.01 0 top
NOREF#335  -  [Pad_e8013]  20.79 53.41 0 top
NOREF#336  -  [Pad_e11041]  104.16 43.75 0 top
NOREF#337  -  [Pad_e7554]  2.09 16.81 0 top
NOREF#338  -  [Pad_e11029]  35.96 26.95 0 top
NOREF#339  -  [Pad_e7236]  135.99 40.01 0 top
NOREF#340  -  [Pad_e2888]  141.96 15.65 0 top
NOREF#341  -  [Pad_e7552]  14.89 22.36 0 top
NOREF#342  -  [Pad_e3133]  152.81 15.53 0 top
NOREF#343  -  [Pad_e6351]  104.09 84.81 0 top
NOREF#344  -  [Pad_e7049]  37.09 67.81 0 top
NOREF#345  -  [Pad_e2278]  141.09 89.5 0 top
NOREF#346  -  [Pad_e5914]  135.99 55.01 0 top
NOREF#347  -  [Pad_e3698]  152.95 76.81 0 top
NOREF#348  -  [Pad_e8025]  11.89 50.21 0 top
NOREF#349  -  [Pad_e5452]  6.09 84.81 0 top
NOREF#350  -  [Pad_e7221]  108.09 32.81 0 top
NOREF#351  -  [Pad_e7057]  37.09 66.81 0 top
NOREF#352  -  [Pad_e6206]  20.39 35.61 0 top
NOREF#353  -  [Pad_e7727]  113.89 67.21 0 top
NOREF#354  -  [Pad_e7855]  39.09 16.81 0 top
NOREF#355  -  [Pad_e7869]  67.19 20.01 0 top
NOREF#356  -  [Pad_e11156]  110.56 71.55 0 top
NOREF#357  -  [Pad_e2964]  152.81 28.22 0 top
NOREF#358  -  [Pad_e5472]  11.89 84.21 0 top
NOREF#359  -  [Pad_e11027]  35.14 11.05 0 top
NOREF#360  -  [Pad_e11113]  43.46 54.55 0 top
NOREF#361  -  [Pad_e7877]  47.2 19.72 0 top
NOREF#362  -  [Pad_e6378]  113.89 84.21 0 top
NOREF#363  -  [Pad_e5464]  33.19 91.01 0 top
NOREF#364  -  [Pad_e2055]  141.1 48 0 top
NOREF#365  -  [Pad_e2154]  142 78.5 0 top
NOREF#366  -  [Pad_e7222]  120.99 36.41 0 top
NOREF#367  -  [Pad_e3796]  152.95 69.21 0 top
NOREF#368  -  [Pad_e11162]  111.46 89.45 0 top
NOREF#369  -  [Pad_e6362]  121.89 87.41 0 top
NOREF#370  -  [Pad_e7704]  105.09 67.81 0 top
NOREF#371  -  [Pad_e7065]  53.49 69.61 0 top
NOREF#372  -  [Pad_e6216]  18.32 39.95 0 top
NOREF#373  -  [Pad_e6376]  135.99 90.01 0 top
NOREF#374  -  [Pad_e7870]  67.19 22.01 0 top
NOREF#375  -  [Pad_e3770]  152.05 70.91 0 top
NOREF#376  -  [Pad_e6061]  101.19 88.01 0 top
NOREF#377  -  [Pad_e6885]  87.49 35.61 0 top
NOREF#378  -  [Pad_e2840]  141.96 17.35 0 top
NOREF#379  -  [Pad_e7218]  105.09 32.81 0 top
NOREF#380  -  [Pad_e11063]  103.24 61.95 0 top
NOREF#381  -  [Pad_e3281]  152.95 55.64 0 top
NOREF#382  -  [Pad_e5617]  101.99 57.01 0 top
NOREF#383  -  [Pad_e11154]  111.46 55.45 0 top
NOREF#384  -  [Pad_e7561]  4.09 15.81 0 top
NOREF#385  -  [Pad_e5755]  40.09 83.81 0 top
NOREF#386  -  [Pad_e7722]  135.99 72.01 0 top
NOREF#387  -  [Pad_e11102]  9.46 21.45 0 top
NOREF#388  -  [Pad_e2936]  141.06 12.25 0 top
NOREF#389  -  [Pad_e8467]  135.99 21.01 0 top
NOREF#390  -  [Pad_e6068]  79.89 84.21 0 top
NOREF#391  -  [Pad_e7074]  52.32 73.95 0 top
NOREF#392  -  [Pad_e7709]  105.09 66.81 0 top
NOREF#393  -  [Pad_e2152]  141.1 63.3 0 top
NOREF#394  -  [Pad_e3693]  152.95 75.91 0 top
NOREF#395  -  [Pad_e3231]  151.91 32.42 0 top
NOREF#396  -  [Pad_e11040]  103.26 43.75 0 top
NOREF#397  -  [Pad_e5449]  3.09 84.81 0 top
NOREF#398  -  [Pad_e5748]  38.09 84.81 0 top
NOREF#399  -  [Pad_e5756]  52.99 87.41 0 top
NOREF#400  -  [Pad_e8166]  101.19 23.01 0 top
NOREF#401  -  [Pad_e7723]  135.99 74.01 0 top
NOREF#402  -  [Pad_e2865]  141.06 17.35 0 top
NOREF#403  -  [Pad_e8018]  33.19 54.01 0 top
NOREF#404  -  [Pad_e6888]  101.19 37.01 0 top
NOREF#405  -  [Pad_e6051]  72.09 83.81 0 top
NOREF#406  -  [Pad_e6366]  121.49 86.61 0 top
NOREF#407  -  [Pad_e8311]  54.79 53.41 0 top
NOREF#408  -  [Pad_e3203]  151.81 35.02 0 top
NOREF#409  -  [Pad_e6197]  6.09 33.81 0 top
NOREF#410  -  [Pad_e8299]  36.09 50.81 0 top
NOREF#411  -  [Pad_e3083]  151.91 19.72 0 top
NOREF#412  -  [Pad_e2104]  142 66.7 0 top
NOREF#413  -  [Pad_e6047]  73.09 84.81 0 top
NOREF#414  -  [Pad_e6869]  84.28 36.06 0 top
NOREF#415  -  [Pad_e3721]  152.95 73.41 0 top
NOREF#416  -  [Pad_e3160]  151.9 13.03 0 top
NOREF#417  -  [Pad_e5754]  39.09 83.81 0 top
NOREF#418  -  [Pad_e5912]  135.19 54.01 0 top
NOREF#419  -  [Pad_e2866]  141.04 18.25 0 top
NOREF#420  -  [Pad_e2767]  141.06 24.95 0 top
NOREF#421  -  [Pad_e1690]  141.1 53.2 0 top
NOREF#422  -  [Pad_e7230]  121.49 35.61 0 top
NOREF#423  -  [Pad_e3524]  152.85 64.24 0 top
NOREF#424  -  [Pad_e11051]  35.04 44.85 0 top
NOREF#425  -  [Pad_e7234]  135.19 39.01 0 top
NOREF#426  -  [Pad_e6720]  18.99 70.41 0 top
NOREF#427  -  [Pad_e11120]  42.56 88.55 0 top
NOREF#428  -  [Pad_e7579]  13.2 19.72 0 top
NOREF#429  -  [Pad_e7062]  53.89 70.41 0 top
NOREF#430  -  [Pad_e11097]  9.46 37.55 0 top
NOREF#431  -  [Pad_e6893]  101.99 39.01 0 top
NOREF#432  -  [Pad_e6889]  101.19 39.01 0 top
NOREF#433  -  [Pad_e11054]  36.05 61.78 0 top
NOREF#434  -  [Pad_e6886]  101.19 38.01 0 top
NOREF#435  -  [Pad_e7413]  73.09 66.81 0 top
NOREF#436  -  [Pad_e7703]  104.09 67.81 0 top
NOREF#437  -  [Pad_e6528]  39.09 33.81 0 top
NOREF#438  -  [Pad_e1665]  142 53.2 0 top
NOREF#439  -  [Pad_e6522]  48.89 39.36 0 top
NOREF#440  -  [Pad_e11112]  42.56 54.55 0 top
NOREF#441  -  [Pad_e3918]  152.04 84.41 0 top
NOREF#442  -  [Pad_e7852]  36.09 16.81 0 top
NOREF#443  -  [Pad_e6209]  33.19 40.01 0 top
NOREF#444  -  [Pad_e3525]  151.95 63.34 0 top
NOREF#445  -  [Pad_e11106]  43.46 21.45 0 top
NOREF#446  -  [Pad_e6552]  47.2 36.72 0 top
NOREF#447  -  [Pad_e6524]  36.09 33.81 0 top
NOREF#448  -  [Pad_e5453]  2.09 83.81 0 top
NOREF#449  -  [Pad_e11161]  111.46 88.55 0 top
NOREF#450  -  [Pad_e1762]  141.09 46.4 0 top
NOREF#451  -  [Pad_e6879]  73.09 32.81 0 top
NOREF#452  -  [Pad_e7853]  37.09 16.81 0 top
NOREF#453  -  [Pad_e6547]  67.99 40.01 0 top
NOREF#454  -  [Pad_e11035]  69.24 27.95 0 top
NOREF#455  -  [Pad_e6369]  135.19 91.01 0 top
NOREF#456  -  [Pad_e11042]  104.16 44.65 0 top
NOREF#457  -  [Pad_e11141]  77.46 20.55 0 top
NOREF#458  -  [Pad_e11036]  103.26 26.85 0 top
NOREF#459  -  [Pad_e7861]  40.09 15.81 0 top
NOREF#460  -  [Pad_e11037]  104.16 26.85 0 top
NOREF#461  -  [Pad_e11158]  111.46 72.45 0 top
NOREF#462  -  [Pad_e11080]  8.56 88.55 0 top
NOREF#463  -  [Pad_e8300]  37.09 50.81 0 top
NOREF#464  -  [Pad_e1714]  141.1 43 0 top
NOREF#465  -  [Pad_e7863]  53.89 19.41 0 top
NOREF#466  -  [Pad_e8447]  118.28 19.06 0 top
NOREF#467  -  [Pad_e11116]  42.56 71.55 0 top
NOREF#468  -  [Pad_e7420]  101.19 72.01 0 top
NOREF#469  -  [Pad_e7235]  135.99 38.01 0 top
NOREF#470  -  [Pad_e6872]  72.09 33.81 0 top
NOREF#471  -  [Pad_e7415]  86.99 70.41 0 top
NOREF#472  -  [Pad_e11114]  43.46 55.45 0 top
NOREF#473  -  [Pad_e7430]  81.2 70.72 0 top
NOREF#474  -  [Pad_e2937]  141.04 13.15 0 top
NOREF#475  -  [Pad_e6733]  18.32 73.95 0 top
NOREF#476  -  [Pad_e11049]  35.96 43.95 0 top
NOREF#477  -  [Pad_e8466]  135.19 22.01 0 top
NOREF#478  -  [Pad_e11047]  69.14 44.75 0 top
NOREF#479  -  [Pad_e5900]  104.09 49.81 0 top
NOREF#480  -  [Pad_e8159]  74.09 15.81 0 top
NOREF#481  -  [Pad_e8459]  121.89 19.41 0 top
NOREF#482  -  [Pad_e1636]  142 58.2 0 top
NOREF#483  -  [Pad_e8167]  101.19 20.01 0 top
NOREF#484  -  [Pad_e7716]  122.39 69.61 0 top
NOREF#485  -  [Pad_e2670]  141.04 33.45 0 top
NOREF#486  -  [Pad_e8316]  67.19 54.01 0 top
NOREF#487  -  [Pad_e8161]  87.89 19.41 0 top
NOREF#488  -  [Pad_e8009]  5.09 49.81 0 top
NOREF#489  -  [Pad_e5450]  4.09 84.81 0 top
NOREF#490  -  [Pad_e7714]  121.89 70.41 0 top
NOREF#491  -  [Pad_e8162]  88.79 19.41 0 top
NOREF#492  -  [Pad_e5769]  52.32 90.95 0 top
NOREF#493  -  [Pad_e7223]  121.89 36.41 0 top
NOREF#494  -  [Pad_e2791]  141.06 22.35 0 top
NOREF#495  -  [Pad_e3845]  152.85 88.71 0 top
NOREF#496  -  [Pad_e5461]  20.39 86.61 0 top
NOREF#497  -  [Pad_e8463]  135.19 21.01 0 top
NOREF#498  -  [Pad_e5598]  71.09 50.81 0 top
NOREF#499  -  [Pad_e6199]  3.09 32.81 0 top
NOREF#500  -  [Pad_e11031]  35.04 27.85 0 top
NOREF#501  -  [Pad_e6871]  71.09 33.81 0 top
NOREF#502  -  [Pad_e5470]  33.99 90.01 0 top
NOREF#503  -  [Pad_e8449]  105.09 16.81 0 top
NOREF#504  -  [Pad_e8175]  81.2 19.72 0 top
NOREF#505  -  [Pad_e6355]  108.09 84.81 0 top
NOREF#506  -  [Pad_e3306]  152.05 55.64 0 top
NOREF#507  -  [Pad_e11145]  111.46 20.55 0 top
NOREF#508  -  [Pad_e6881]  86.99 36.41 0 top
NOREF#509  -  [Pad_e5899]  108.09 50.81 0 top
NOREF#510  -  [Pad_e7061]  52.99 70.41 0 top
NOREF#511  -  [Pad_e8318]  67.99 55.01 0 top
NOREF#512  -  [Pad_e8007]  3.09 49.81 0 top
NOREF#513  -  [Pad_e11045]  70.06 43.85 0 top
NOREF#514  -  [Pad_e7243]  120.32 39.95 0 top
NOREF#515  -  [Pad_e8312]  54.39 52.61 0 top
NOREF#516  -  [Pad_e3183]  152.71 35.92 0 top
NOREF#517  -  [Pad_e8314]  67.19 55.01 0 top
NOREF#518  -  [Pad_e2742]  141.96 24.95 0 top
NOREF#519  -  [Pad_e5609]  88.79 53.41 0 top
NOREF#520  -  [Pad_e11072]  35.06 78.15 0 top
NOREF#521  -  [Pad_e11020]  69.16 10.05 0 top
NOREF#522  -  [Pad_e7874]  67.99 22.01 0 top
NOREF#523  -  [Pad_e3477]  152.95 41.34 0 top
NOREF#524  -  [Pad_e11142]  77.46 21.45 0 top
NOREF#525  -  [Pad_e1691]  141.09 54.1 0 top
NOREF#526  -  [Pad_e2789]  141.96 22.35 0 top
NOREF#527  -  [Pad_e7205]  118.28 36.06 0 top
NOREF#528  -  [Pad_e2174]  142 79.4 0 top
NOREF#529  -  [Pad_e6193]  2.09 33.81 0 top
NOREF#530  -  [Pad_e7405]  70.09 67.81 0 top
NOREF#531  -  [Pad_e11111]  42.54 38.45 0 top
NOREF#532  -  [Pad_e8154]  74.09 16.81 0 top
NOREF#533  -  [Pad_e5770]  45.89 84.21 0 top
NOREF#534  -  [Pad_e7204]  116.89 39.36 0 top
NOREF#535  -  [Pad_e8457]  108.09 15.81 0 top
NOREF#536  -  [Pad_e6058]  87.49 86.61 0 top
NOREF#537  -  [Pad_e7557]  5.09 16.81 0 top
NOREF#538  -  [Pad_e1685]  142 54.1 0 top
NOREF#539  -  [Pad_e11048]  35.06 43.95 0 top
NOREF#540  -  [Pad_e6877]  71.09 32.81 0 top
NOREF#541  -  [Pad_e5894]  118.28 53.06 0 top
NOREF#542  -  [Pad_e3497]  152.04 41.34 0 top
NOREF#543  -  [Pad_e7721]  135.19 73.01 0 top
NOREF#544  -  [Pad_e7574]  33.99 23.01 0 top
NOREF#545  -  [Pad_e6883]  88.79 36.41 0 top
NOREF#546  -  [Pad_e5753]  38.09 83.81 0 top
NOREF#547  -  [Pad_e7705]  106.09 67.81 0 top
NOREF#548  -  [Pad_e2251]  141.09 74.4 0 top
NOREF#549  -  [Pad_e8173]  86.32 22.96 0 top
NOREF#550  -  [Pad_e11122]  43.46 89.45 0 top
NOREF#551  -  [Pad_e3546]  152.95 60.74 0 top
NOREF#552  -  [Pad_e7211]  107.09 33.81 0 top
NOREF#553  -  [Pad_e8001]  2.09 50.81 0 top
NOREF#554  -  [Pad_e11118]  43.46 72.45 0 top
NOREF#555  -  [Pad_e2741]  141.04 28.35 0 top
NOREF#556  -  [Pad_e2915]  141.96 13.15 0 top
NOREF#557  -  [Pad_e2131]  142 64.2 0 top
NOREF#558  -  [Pad_e8022]  33.99 54.01 0 top
NOREF#559  -  [Pad_e2081]  141.1 68.3 0 top
NOREF#560  -  [Pad_e3056]  151.9 23.12 0 top
NOREF#561  -  [Pad_e6539]  54.79 36.41 0 top
NOREF#562  -  [Pad_e7244]  113.89 33.21 0 top
NOREF#563  -  [Pad_e8024]  18.32 56.95 0 top
NOREF#564  -  [Pad_e2229]  142 74.4 0 top
NOREF#565  -  [Pad_e8005]  6.09 50.81 0 top
NOREF#566  -  [Pad_e8170]  101.99 23.01 0 top
NOREF#567  -  [Pad_e5463]  33.19 89.01 0 top
NOREF#568  -  [Pad_e6526]  38.09 33.81 0 top
NOREF#569  -  [Pad_e7577]  18.32 22.96 0 top
NOREF#570  -  [Pad_e5905]  120.99 53.41 0 top
NOREF#571  -  [Pad_e8021]  33.99 57.01 0 top
NOREF#572  -  [Pad_e7701]  116.89 73.36 0 top
NOREF#573  -  [Pad_e6724]  19.49 69.61 0 top
NOREF#574  -  [Pad_e11115]  42.54 55.45 0 top
NOREF#575  -  [Pad_e5465]  33.19 88.01 0 top
NOREF#576  -  [Pad_e3181]  152.81 29.82 0 top
NOREF#577  -  [Pad_e3013]  151.9 25.72 0 top
NOREF#578  -  [Pad_e5903]  107.09 49.81 0 top
NOREF#579  -  [Pad_e8000]  16.28 53.06 0 top
NOREF#580  -  [Pad_e7865]  54.39 18.61 0 top
NOREF#581  -  [Pad_e7237]  135.99 37.01 0 top
NOREF#582  -  [Pad_e5898]  107.09 50.81 0 top
NOREF#583  -  [Pad_e11024]  35.16 10.15 0 top
NOREF#584  -  [Pad_e6373]  135.99 89.01 0 top
NOREF#585  -  [Pad_e5757]  53.89 87.41 0 top
NOREF#586  -  [Pad_e7066]  67.19 72.01 0 top
NOREF#587  -  [Pad_e7873]  67.99 20.01 0 top
NOREF#588  -  [Pad_e6523]  50.28 36.06 0 top
NOREF#589  -  [Pad_e7414]  74.09 66.81 0 top
NOREF#590  -  [Pad_e6048]  74.09 84.81 0 top
NOREF#591  -  [Pad_e5749]  39.09 84.81 0 top
NOREF#592  -  [Pad_e6712]  4.09 67.81 0 top
NOREF#593  -  [Pad_e3722]  152.95 74.31 0 top
NOREF#594  -  [Pad_e11127]  76.54 89.45 0 top
NOREF#595  -  [Pad_e8303]  40.09 50.81 0 top
NOREF#596  -  [Pad_e11073]  35.96 78.15 0 top
NOREF#597  -  [Pad_e5761]  67.19 89.01 0 top
NOREF#598  -  [Pad_e5462]  19.49 86.61 0 top
NOREF#599  -  [Pad_e5455]  4.09 83.81 0 top
NOREF#600  -  [Pad_e7858]  37.09 15.81 0 top
NOREF#601  -  [Pad_e8156]  71.09 15.81 0 top
NOREF#602  -  [Pad_e7058]  38.09 66.81 0 top
NOREF#603  -  [Pad_e7429]  79.89 67.21 0 top
NOREF#604  -  [Pad_e7067]  67.19 74.01 0 top
NOREF#605  -  [Pad_e8307]  39.09 49.81 0 top
NOREF#606  -  [Pad_e2250]  141.1 73.5 0 top
NOREF#607  -  [Pad_e6895]  79.89 33.21 0 top
NOREF#608  -  [Pad_e6198]  2.09 32.81 0 top
NOREF#609  -  [Pad_e2103]  142 65.8 0 top
NOREF#610  -  [Pad_e8012]  19.89 53.41 0 top
NOREF#611  -  [Pad_e3867]  151.95 88.71 0 top
NOREF#612  -  [Pad_e11100]  8.56 20.55 0 top
NOREF#613  -  [Pad_e6544]  67.19 37.01 0 top
NOREF#614  -  [Pad_e2277]  141.1 88.6 0 top
NOREF#615  -  [Pad_e6729]  33.99 72.01 0 top
NOREF#616  -  [Pad_e3771]  152.04 71.81 0 top
NOREF#617  -  [Pad_e3301]  152.95 56.54 0 top
NOREF#618  -  [Pad_e3673]  152.04 79.41 0 top
NOREF#619  -  [Pad_e11125]  77.46 88.55 0 top
NOREF#620  -  [Pad_e5471]  18.32 90.95 0 top
NOREF#621  -  [Pad_e7717]  121.49 69.61 0 top
NOREF#622  -  [Pad_e8317]  67.19 56.01 0 top
NOREF#623  -  [Pad_e5596]  84.28 53.06 0 top
NOREF#624  -  [Pad_e7424]  101.99 72.01 0 top
NOREF#625  -  [Pad_e2816]  141.96 19.85 0 top
NOREF#626  -  [Pad_e11136]  76.56 37.55 0 top
NOREF#627  -  [Pad_e6538]  53.89 36.41 0 top
NOREF#628  -  [Pad_e11091]  8.54 72.45 0 top
NOREF#629  -  [Pad_e8470]  135.99 22.01 0 top
NOREF#630  -  [Pad_e5616]  101.99 55.01 0 top
NOREF#631  -  [Pad_e11075]  35.04 79.05 0 top
NOREF#632  -  [Pad_e6892]  101.99 37.01 0 top
NOREF#633  -  [Pad_e6873]  73.09 33.81 0 top
NOREF#634  -  [Pad_e8322]  52.32 56.95 0 top
NOREF#635  -  [Pad_e3132]  152.81 14.62 0 top
NOREF#636  -  [Pad_e11159]  110.54 72.45 0 top
NOREF#637  -  [Pad_e5448]  2.09 84.81 0 top
NOREF#638  -  [Pad_e6352]  105.09 84.81 0 top
NOREF#639  -  [Pad_e2986]  151.9 28.22 0 top
NOREF#640  -  [Pad_e5896]  105.09 50.81 0 top
NOREF#641  -  [Pad_e7064]  54.39 69.61 0 top
NOREF#642  -  [Pad_e7209]  105.09 33.81 0 top
NOREF#643  -  [Pad_e8453]  104.09 15.81 0 top
NOREF#644  -  [Pad_e3279]  152.95 40.44 0 top
NOREF#645  -  [Pad_e8454]  105.09 15.81 0 top
NOREF#646  -  [Pad_e7428]  86.32 73.95 0 top
NOREF#647  -  [Pad_e8157]  72.09 15.81 0 top
NOREF#648  -  [Pad_e2034]  142 48.9 0 top
NOREF#649  -  [Pad_e3257]  151.91 29.82 0 top
NOREF#650  -  [Pad_e5904]  108.09 49.81 0 top
NOREF#651  -  [Pad_e3062]  152.81 20.62 0 top
NOREF#652  -  [Pad_e11138]  77.46 38.45 0 top
NOREF#653  -  [Pad_e6726]  33.19 74.01 0 top
NOREF#654  -  [Pad_e6069]  81.2 87.72 0 top
NOREF#655  -  [Pad_e2958]  151.91 12.12 0 top
NOREF#656  -  [Pad_e2056]  141.09 48.9 0 top
NOREF#657  -  [Pad_e6709]  16.28 70.06 0 top
NOREF#658  -  [Pad_e11050]  35.96 44.85 0 top
NOREF#659  -  [Pad_e7231]  135.19 38.01 0 top
NOREF#660  -  [Pad_e1761]  141.1 45.5 0 top
NOREF#661  -  [Pad_e7563]  6.09 15.81 0 top
NOREF#662  -  [Pad_e3105]  152.81 18.12 0 top
NOREF#663  -  [Pad_e11046]  70.06 44.75 0 top
NOREF#664  -  [Pad_e5918]  120.32 56.95 0 top
NOREF#665  -  [Pad_e11151]  110.54 38.45 0 top
NOREF#666  -  [Pad_e6887]  101.19 40.01 0 top
NOREF#667  -  [Pad_e6708]  14.89 73.36 0 top
NOREF#668  -  [Pad_e3895]  152.04 87.01 0 top
NOREF#669  -  [Pad_e7409]  74.09 67.81 0 top
NOREF#670  -  [Pad_e11147]  110.54 21.45 0 top
NOREF#671  -  [Pad_e2252]  142 88.6 0 top
NOREF#672  -  [Pad_e11119]  42.54 72.45 0 top
NOREF#673  -  [Pad_e3797]  152.05 68.31 0 top
NOREF#674  -  [Pad_e1642]  142 56.6 0 top
NOREF#675  -  [Pad_e3111]  151.9 18.12 0 top
NOREF#676  -  [Pad_e5919]  113.89 50.21 0 top
NOREF#677  -  [Pad_e6066]  101.99 90.01 0 top
NOREF#678  -  [Pad_e7219]  106.09 32.81 0 top
NOREF#679  -  [Pad_e8302]  39.09 50.81 0 top
NOREF#680  -  [Pad_e7427]  101.99 73.01 0 top
NOREF#681  -  [Pad_e7063]  54.79 70.41 0 top
NOREF#682  -  [Pad_e5745]  50.28 87.06 0 top
NOREF#683  -  [Pad_e11067]  103.24 78.85 0 top
NOREF#684  -  [Pad_e8158]  73.09 15.81 0 top
NOREF#685  -  [Pad_e7569]  33.19 21.01 0 top
NOREF#686  -  [Pad_e3328]  152.95 53.14 0 top
NOREF#687  -  [Pad_e2153]  141.09 64.2 0 top
NOREF#688  -  [Pad_e3699]  152.05 75.91 0 top
NOREF#689  -  [Pad_e11018]  104.16 10.85 0 top
NOREF#690  -  [Pad_e7073]  67.99 73.01 0 top
NOREF#691  -  [Pad_e7410]  70.09 66.81 0 top
NOREF#692  -  [Pad_e5747]  37.09 84.81 0 top
NOREF#693  -  [Pad_e2790]  141.96 23.25 0 top
NOREF#694  -  [Pad_e3454]  152.95 43.84 0 top
NOREF#695  -  [Pad_e7726]  120.32 73.95 0 top
NOREF#696  -  [Pad_e6196]  5.09 33.81 0 top
NOREF#697  -  [Pad_e5911]  135.19 57.01 0 top
NOREF#698  -  [Pad_e7707]  108.09 67.81 0 top
NOREF#699  -  [Pad_e3894]  152.05 86.11 0 top
NOREF#700  -  [Pad_e5468]  33.99 91.01 0 top
NOREF#701  -  [Pad_e1712]  142 43 0 top
NOREF#702  -  [Pad_e11095]  8.55 55.4 0 top
NOREF#703  -  [Pad_e11070]  70.06 78.95 0 top
NOREF#704  -  [Pad_e11038]  104.16 27.75 0 top
NOREF#705  -  [Pad_e6891]  101.99 40.01 0 top
NOREF#706  -  [Pad_e2987]  152.81 24.82 0 top
NOREF#707  -  [Pad_e5608]  87.89 53.41 0 top
NOREF#708  -  [Pad_e7075]  45.89 67.21 0 top
NOREF#709  -  [Pad_e6211]  33.19 39.01 0 top
NOREF#710  -  [Pad_e11017]  104.16 9.95 0 top
NOREF#711  -  [Pad_e3428]  152.05 45.54 0 top
NOREF#712  -  [Pad_e2713]  141.04 30.85 0 top
NOREF#713  -  [Pad_e11146]  111.46 21.45 0 top
NOREF#714  -  [Pad_e5915]  135.99 57.01 0 top
NOREF#715  -  [Pad_e2228]  142 73.5 0 top
NOREF#716  -  [Pad_e11081]  9.46 88.55 0 top
NOREF#717  -  [Pad_e6731]  33.99 71.01 0 top
NOREF#718  -  [Pad_e8163]  88.39 18.61 0 top
NOREF#719  -  [Pad_e8462]  121.49 18.61 0 top
NOREF#720  -  [Pad_e6546]  67.99 38.01 0 top
NOREF#721  -  [Pad_e2375]  140.96 35.15 0 top
NOREF#722  -  [Pad_e11071]  69.14 78.95 0 top
NOREF#723  -  [Pad_e6721]  19.89 70.41 0 top
NOREF#724  -  [Pad_e6050]  71.09 83.81 0 top
NOREF#725  -  [Pad_e5460]  20.79 87.41 0 top
NOREF#726  -  [Pad_e7867]  67.19 21.01 0 top
NOREF#727  -  [Pad_e7232]  135.19 40.01 0 top
NOREF#728  -  [Pad_e5602]  70.09 49.81 0 top
NOREF#729  -  [Pad_e5917]  135.99 56.01 0 top
NOREF#730  -  [Pad_e6735]  13.2 70.72 0 top
NOREF#731  -  [Pad_e8473]  115.2 19.72 0 top
NOREF#732  -  [Pad_e6732]  33.99 73.01 0 top
NOREF#733  -  [Pad_e8004]  5.09 50.81 0 top
NOREF#734  -  [Pad_e2300]  142 87 0 top
NOREF#735  -  [Pad_e8313]  53.49 52.61 0 top
NOREF#736  -  [Pad_e7854]  38.09 16.81 0 top
NOREF#737  -  [Pad_e11132]  76.56 54.55 0 top
NOREF#738  -  [Pad_e3350]  152.04 54.04 0 top
NOREF#739  -  [Pad_e11089]  9.46 71.55 0 top
NOREF#740  -  [Pad_e8455]  106.09 15.81 0 top
NOREF#741  -  [Pad_e11060]  103.26 61.05 0 top
NOREF#742  -  [Pad_e8171]  101.99 20.01 0 top
NOREF#743  -  [Pad_e5621]  79.89 50.21 0 top
NOREF#744  -  [Pad_e3356]  152.95 51.44 0 top
NOREF#745  -  [Pad_e6711]  3.09 67.81 0 top
NOREF#746  -  [Pad_e11028]  35.06 26.95 0 top
NOREF#747  -  [Pad_e1593]  142 59.1 0 top
NOREF#748  -  [Pad_e8165]  101.19 21.01 0 top
NOREF#749  -  [Pad_e3355]  152.95 50.54 0 top
NOREF#750  -  [Pad_e11092]  8.57 54.5 0 top
NOREF#751  -  [Pad_e5597]  70.09 50.81 0 top
NOREF#752  -  [Pad_e6214]  33.99 37.01 0 top
NOREF#753  -  [Pad_e3154]  151.9 15.53 0 top
NOREF#754  -  [Pad_e6714]  6.09 67.81 0 top
NOREF#755  -  [Pad_e3404]  152.05 48.04 0 top
NOREF#756  -  [Pad_e6356]  104.09 83.81 0 top
NOREF#757  -  [Pad_e2348]  141.1 83.6 0 top
NOREF#758  -  [Pad_e3405]  152.04 48.94 0 top
NOREF#759  -  [Pad_e7071]  67.99 74.01 0 top
NOREF#760  -  [Pad_e6730]  33.99 74.01 0 top
NOREF#761  -  [Pad_e7422]  101.19 71.01 0 top
NOREF#762  -  [Pad_e6202]  6.09 32.81 0 top
NOREF#763  -  [Pad_e7220]  107.09 32.81 0 top
NOREF#764  -  [Pad_e2223]  141.09 76.9 0 top
NOREF#765  -  [Pad_e6353]  106.09 84.81 0 top
NOREF#766  -  [Pad_e6545]  67.19 39.01 0 top
NOREF#767  -  [Pad_e3769]  152.95 71.81 0 top
NOREF#768  -  [Pad_e3747]  152.04 74.31 0 top
NOREF#769  -  [Pad_e11082]  9.46 89.45 0 top
NOREF#770  -  [Pad_e6348]  116.89 90.36 0 top
NOREF#771  -  [Pad_e5907]  122.79 53.41 0 top
NOREF#772  -  [Pad_e3035]  152.81 23.12 0 top
NOREF#773  -  [Pad_e2202]  142 76.9 0 top
NOREF#774  -  [Pad_e1641]  142 55.7 0 top
NOREF#775  -  [Pad_e11039]  103.24 27.75 0 top
NOREF#776  -  [Pad_e3036]  151.91 22.22 0 top
NOREF#777  -  [Pad_e7724]  135.99 71.01 0 top
NOREF#778  -  [Pad_e6727]  33.19 71.01 0 top
NOREF#779  -  [Pad_e2299]  142 86.1 0 top
NOREF#780  -  [Pad_e6870]  70.09 33.81 0 top
NOREF#781  -  [Pad_e8319]  67.99 57.01 0 top
NOREF#782  -  [Pad_e7560]  3.09 15.81 0 top
NOREF#783  -  [Pad_e6534]  40.09 32.81 0 top
NOREF#784  -  [Pad_e6067]  86.32 90.95 0 top
NOREF#785  -  [Pad_e7713]  120.99 70.41 0 top
NOREF#786  -  [Pad_e7555]  3.09 16.81 0 top
NOREF#787  -  [Pad_e6713]  5.09 67.81 0 top
NOREF#788  -  [Pad_e6896]  81.2 36.72 0 top
NOREF#789  -  [Pad_e5622]  81.2 53.72 0 top
NOREF#790  -  [Pad_e6365]  122.39 86.61 0 top
NOREF#791  -  [Pad_e8465]  135.19 20.01 0 top
NOREF#792  -  [Pad_e6884]  88.39 35.61 0 top
NOREF#793  -  [Pad_e2768]  141.04 25.85 0 top
NOREF#794  -  [Pad_e8320]  67.99 54.01 0 top
NOREF#795  -  [Pad_e7559]  2.09 15.81 0 top
NOREF#796  -  [Pad_e5752]  37.09 83.81 0 top
NOREF#797  -  [Pad_e1663]  141.1 55.7 0 top
NOREF#798  -  [Pad_e11019]  103.24 10.85 0 top
NOREF#799  -  [Pad_e7568]  19.49 18.61 0 top
NOREF#800  -  [Pad_e3748]  152.95 70.91 0 top
NOREF#801  -  [Pad_e5893]  116.89 56.36 0 top
NOREF#802  -  [Pad_e11133]  77.46 54.55 0 top
NOREF#803  -  [Pad_e5751]  36.09 83.81 0 top
NOREF#804  -  [Pad_e6718]  5.09 66.81 0 top
NOREF#805  -  [Pad_e7556]  4.09 16.81 0 top
NOREF#806  -  [Pad_e2033]  142 48 0 top
NOREF#807  -  [Pad_e3012]  151.91 24.82 0 top
NOREF#808  -  [Pad_e7864]  54.79 19.41 0 top
NOREF#809  -  [Pad_e8015]  19.49 52.61 0 top
NOREF#810  -  [Pad_e11023]  69.14 10.95 0 top
NOREF#811  -  [Pad_e5771]  47.2 87.72 0 top
NOREF#812  -  [Pad_e3502]  152.95 58.14 0 top
NOREF#813  -  [Pad_e3329]  152.95 54.04 0 top
NOREF#814  -  [Pad_e8461]  122.39 18.61 0 top
NOREF#815  -  [Pad_e7411]  71.09 66.81 0 top
NOREF#816  -  [Pad_e7872]  67.99 23.01 0 top
NOREF#817  -  [Pad_e8155]  70.09 15.81 0 top
NOREF#818  -  [Pad_e3624]  152.95 81.91 0 top
NOREF#819  -  [Pad_e2321]  141.09 87 0 top
NOREF#820  -  [Pad_e8160]  86.99 19.41 0 top
NOREF#821  -  [Pad_e5604]  72.09 49.81 0 top
NOREF#822  -  [Pad_e6059]  101.19 89.01 0 top
NOREF#823  -  [Pad_e11096]  8.56 37.55 0 top
NOREF#824  -  [Pad_e1615]  141.09 59.1 0 top
NOREF#825  -  [Pad_e6734]  11.89 67.21 0 top
NOREF#826  -  [Pad_e11144]  110.56 20.55 0 top
NOREF#827  -  [Pad_e2105]  141.1 65.8 0 top
NOREF#828  -  [Pad_e11068]  69.16 78.05 0 top
NOREF#829  -  [Pad_e7710]  106.09 66.81 0 top
NOREF#830  -  [Pad_e11137]  77.46 37.55 0 top
NOREF#831  -  [Pad_e6543]  67.19 40.01 0 top
NOREF#832  -  [Pad_e6374]  135.99 91.01 0 top
NOREF#833  -  [Pad_e8020]  33.99 55.01 0 top
NOREF#834  -  [Pad_e11149]  111.46 37.55 0 top
NOREF#835  -  [Pad_e7576]  33.99 22.01 0 top
NOREF#836  -  [Pad_e5746]  36.09 84.81 0 top
NOREF#837  -  [Pad_e11110]  43.46 38.45 0 top
NOREF#838  -  [Pad_e5603]  71.09 49.81 0 top
NOREF#839  -  [Pad_e6056]  88.79 87.41 0 top
NOREF#840  -  [Pad_e11026]  36.06 11.05 0 top
NOREF#841  -  [Pad_e6191]  14.89 39.36 0 top
NOREF#842  -  [Pad_e11030]  35.96 27.85 0 top
NOREF#843  -  [Pad_e11044]  69.16 43.85 0 top
NOREF#844  -  [Pad_e11061]  104.16 61.05 0 top
NOREF#845  -  [Pad_e3426]  152.95 45.54 0 top
NOREF#846  -  [Pad_e8150]  70.09 16.81 0 top
NOREF#847  -  [Pad_e3330]  152.05 53.14 0 top
NOREF#848  -  [Pad_e6532]  38.09 32.81 0 top
NOREF#849  -  [Pad_e5765]  67.99 89.01 0 top
NOREF#850  -  [Pad_e3307]  152.04 56.54 0 top
NOREF#851  -  [Pad_e7242]  135.99 39.01 0 top
NOREF#852  -  [Pad_e6195]  4.09 33.81 0 top
NOREF#853  -  [Pad_e11104]  42.56 20.55 0 top
NOREF#854  -  [Pad_e11109]  43.46 37.55 0 top
NOREF#855  -  [Pad_e3377]  152.05 50.54 0 top
NOREF#856  -  [Pad_e8324]  47.2 53.72 0 top
NOREF#857  -  [Pad_e5600]  73.09 50.81 0 top
NOREF#858  -  [Pad_e6372]  135.19 90.01 0 top
NOREF#859  -  [Pad_e7706]  107.09 67.81 0 top
NOREF#860  -  [Pad_e2860]  141.96 18.25 0 top
NOREF#861  -  [Pad_e6723]  20.39 69.61 0 top
NOREF#862  -  [Pad_e8010]  6.09 49.81 0 top
NOREF#863  -  [Pad_e7999]  14.89 56.36 0 top
NOREF#864  -  [Pad_e7875]  52.32 22.96 0 top
NOREF#865  -  [Pad_e6350]  118.28 87.06 0 top
NOREF#866  -  [Pad_e2125]  141.09 66.7 0 top
NOREF#867  -  [Pad_e11056]  69.16 60.95 0 top
NOREF#868  -  [Pad_e2669]  141.06 32.55 0 top
NOREF#869  -  [Pad_e8016]  33.19 55.01 0 top
NOREF#870  -  [Pad_e5760]  53.49 86.61 0 top
NOREF#871  -  [Pad_e7426]  101.99 71.01 0 top
NOREF#872  -  [Pad_e8464]  135.19 23.01 0 top
NOREF#873  -  [Pad_e11069]  70.06 78.05 0 top
NOREF#874  -  [Pad_e11126]  77.46 89.45 0 top
NOREF#875  -  [Pad_e5613]  101.19 57.01 0 top
NOREF#876  -  [Pad_e3526]  151.94 64.24 0 top
NOREF#877  -  [Pad_e2326]  142 83.6 0 top
NOREF#878  -  [Pad_e6716]  3.09 66.81 0 top
NOREF#879  -  [Pad_e2889]  141.06 14.75 0 top
NOREF#880  -  [Pad_e6057]  88.39 86.61 0 top
NOREF#881  -  [Pad_e6550]  52.32 39.95 0 top
NOREF#882  -  [Pad_e8164]  87.49 18.61 0 top
NOREF#883  -  [Pad_e2350]  141.86 35.15 0 top
NOREF#884  -  [Pad_e5768]  67.99 90.01 0 top
NOREF#885  -  [Pad_e7718]  135.19 72.01 0 top
NOREF#886  -  [Pad_e6217]  11.89 33.21 0 top
NOREF#887  -  [Pad_e2179]  141.1 78.5 0 top
NOREF#888  -  [Pad_e3085]  152.81 17.22 0 top
NOREF#889  -  [Pad_e3819]  152.95 66.71 0 top
NOREF#890  -  [Pad_e11094]  9.47 55.4 0 top
NOREF#891  -  [Pad_e2349]  141.09 84.5 0 top
NOREF#892  -  [Pad_e5459]  19.89 87.41 0 top
NOREF#893  -  [Pad_e6215]  33.99 39.01 0 top
NOREF#894  -  [Pad_e7043]  48.89 73.36 0 top
NOREF#895  -  [Pad_e5599]  72.09 50.81 0 top
NOREF#896  -  [Pad_e11058]  70.06 61.85 0 top
NOREF#897  -  [Pad_e7425]  101.99 74.01 0 top
NOREF#898  -  [Pad_e2914]  141.96 12.25 0 top
NOREF#899  -  [Pad_e7068]  67.19 71.01 0 top
NOREF#900  -  [Pad_e5451]  5.09 84.81 0 top
NOREF#901  -  [Pad_e3623]  152.95 81.01 0 top
NOREF#902  -  [Pad_e2719]  141.96 28.35 0 top
NOREF#903  -  [Pad_e8019]  33.19 56.01 0 top
NOREF#904  -  [Pad_e3574]  152.95 59.04 0 top
NOREF#905  -  [Pad_e8306]  38.09 49.81 0 top
NOREF#906  -  [Pad_e11103]  8.54 21.45 0 top
NOREF#907  -  [Pad_e5454]  3.09 83.81 0 top
NOREF#908  -  [Pad_e6212]  33.99 38.01 0 top
NOREF#909  -  [Pad_e11059]  69.14 61.85 0 top
NOREF#910  -  [Pad_e3209]  152.81 32.42 0 top
NOREF#911  -  [Pad_e8315]  67.19 57.01 0 top
NOREF#912  -  [Pad_e7044]  50.28 70.06 0 top
NOREF#913  -  [Pad_e5466]  33.19 90.01 0 top
NOREF#914  -  [Pad_e7712]  108.09 66.81 0 top
NOREF#915  -  [Pad_e6046]  72.09 84.81 0 top
NOREF#916  -  [Pad_e7571]  33.19 20.01 0 top
NOREF#917  -  [Pad_e2887]  141.96 14.75 0 top
NOREF#918  -  [Pad_e8172]  101.99 22.01 0 top
NOREF#919  -  [Pad_e11052]  35.15 60.88 0 top
NOREF#920  -  [Pad_e6203]  18.99 36.41 0 top
Q1  AO3401A  [SOT-23-3_L2.9-W1.3-P1.90-LS2.4-BR]  23.52 85.41 270 top
Q2  AO3401A  [SOT-23-3_L2.9-W1.3-P1.90-LS2.4-BR]  91.52 51.41 270 top
Q9  AO3401A  [SOT-23-3_L2.9-W1.3-P1.90-LS2.4-BR]  57.52 85.41 270 top
Q10  AO3401A  [SOT-23-3_L2.9-W1.3-P1.90-LS2.4-BR]  125.52 51.41 270 top
Q17  AO3401A  [SOT-23-3_L2.9-W1.3-P1.90-LS2.4-BR]  91.52 85.41 270 top
